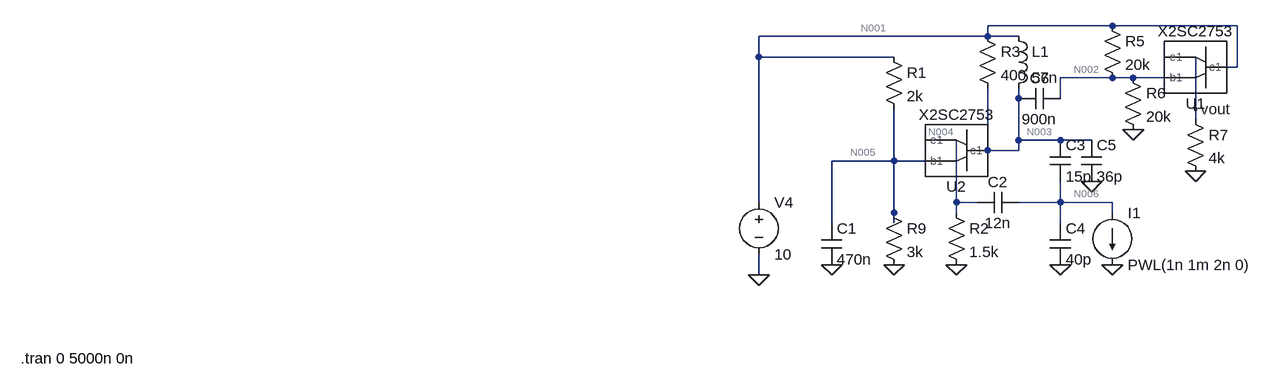
[diagram p0: schematic Oscillator - Copy - Copy.asc]
Oscillator - Copy - Copy.asc, the LTspice schematic file:
Version 4
SHEET 1 2276 680
WIRE 1216 -48 1024 -48
WIRE 1408 -48 1216 -48
WIRE 1024 -32 1024 -48
WIRE 1024 -32 672 -32
WIRE 1072 -32 1024 -32
WIRE 672 0 672 -32
WIRE 880 0 672 0
WIRE 1344 0 1296 0
WIRE 1408 16 1408 -48
WIRE 1408 16 1392 16
WIRE 1216 32 1136 32
WIRE 1248 32 1216 32
WIRE 1296 32 1248 32
WIRE 1072 64 1072 48
WIRE 1136 64 1136 32
WIRE 1344 80 1344 0
WIRE 1344 96 1344 80
WIRE 976 128 928 128
WIRE 1072 128 1072 64
WIRE 1136 128 1072 128
WIRE 1184 128 1136 128
WIRE 1024 144 1024 48
WIRE 1072 144 1072 128
WIRE 1072 144 1024 144
WIRE 880 160 880 80
WIRE 880 160 784 160
WIRE 928 160 880 160
WIRE 672 224 672 0
WIRE 976 224 976 128
WIRE 1008 224 976 224
WIRE 1136 224 1136 192
WIRE 1136 224 1072 224
WIRE 1216 224 1136 224
WIRE 880 240 880 160
WIRE 976 240 976 224
WIRE 1216 240 1216 224
WIRE 784 256 784 160
WIRE 880 256 880 240
WIRE 1136 256 1136 224
WIRE 672 336 672 304
FLAG 672 336 0
FLAG 880 320 0
FLAG 1216 320 0
FLAG 976 320 0
FLAG 784 320 0
FLAG 1136 320 0
FLAG 1248 112 0
FLAG 1344 176 0
FLAG 1184 192 0
FLAG 1344 80 vout
SYMBOL AutoGenerated\\X2SC2753 976 144 R180
SYMATTR InstName U2
SYMBOL res 864 224 R0
SYMATTR InstName R9
SYMATTR Value 3k
SYMBOL voltage 672 208 R0
WINDOW 123 0 0 Left 0
WINDOW 39 0 0 Left 0
SYMATTR InstName V4
SYMATTR Value 10
SYMBOL current 1216 240 R0
WINDOW 123 0 0 Left 0
WINDOW 39 0 0 Left 0
SYMATTR InstName I1
SYMATTR Value PWL(1n 1m 2n 0)
SYMBOL res 864 -16 R0
SYMATTR InstName R1
SYMATTR Value 2k
SYMBOL res 960 224 R0
SYMATTR InstName R2
SYMATTR Value 1.5k
SYMBOL cap 768 256 R0
SYMATTR InstName C1
SYMATTR Value 470n
SYMBOL ind 1056 -48 R0
SYMATTR InstName L1
SYMATTR Value 57n
SYMBOL cap 1072 208 R90
WINDOW 0 0 32 VBottom 2
WINDOW 3 32 32 VTop 2
SYMATTR InstName C2
SYMATTR Value 12n
SYMBOL cap 1120 128 R0
SYMATTR InstName C3
SYMATTR Value 15p
SYMBOL cap 1120 256 R0
SYMATTR InstName C4
SYMATTR Value 40p
SYMBOL res 1008 -48 R0
SYMATTR InstName R3
SYMATTR Value 400
SYMBOL cap 1168 128 R0
SYMATTR InstName C5
SYMATTR Value 36p
SYMBOL AutoGenerated\\X2SC2753 1344 16 R180
SYMATTR InstName U1
SYMBOL res 1200 -64 R0
SYMATTR InstName R5
SYMATTR Value 20k
SYMBOL res 1232 16 R0
SYMATTR InstName R6
SYMATTR Value 20k
SYMBOL res 1328 80 R0
SYMATTR InstName R7
SYMATTR Value 4k
SYMBOL cap 1136 48 R90
WINDOW 0 0 32 VBottom 2
WINDOW 3 32 32 VTop 2
SYMATTR InstName C6
SYMATTR Value 900n
TEXT -464 464 Left 2 !.tran 0 5000n 0n

The netlist it stands for:
* Oscillator - Copy - Copy.asc
XU2 N003 N005 N004 X2SC2753  ; pins c1 b1 e1
R9 N005 0 3k
V4 N001 0 10
I1 N006 0 PWL(1n 1m 2n 0)
R1 N001 N005 2k
R2 N004 0 1.5k
C1 N005 0 470n
L1 N001 N003 57n
C2 N006 N004 12n
C3 N003 N006 15p
C4 N006 0 40p
R3 N001 N003 400
C5 N003 0 36p
XU1 N001 N002 vout X2SC2753  ; pins c1 b1 e1
R5 N001 N002 20k
R6 N002 0 20k
R7 vout 0 4k
C6 N002 N003 900n
.tran 0 5000n 0n
.lib C:/Users/jonathansharir-smith/Desktop/251SPICE/Lab2/narrowband\2SC2753.lib
.backanno
.end

* Results of the author's LTspice run, read from the files saved beside the schematic
* Operating Point, zero values left out:
*   V(n005) = 5.942 V
*   V(n003) = 10 V
*   V(n004) = 5.141 V
*   V(n001) = 10 V
*   V(n006) = -1 GV
*   V(n002) = 4.844 V
*   V(vout) = 4.076 V
*   I(C2) = -12 pA
*   I(L1) = 3.379 mA
*   I(I1) = 1 mA
*   I(R9) = 1.981 mA
*   I(R1) = 2.029 mA
*   I(R2) = 3.427 mA
*   I(R3) = 8.447 nA
*   I(R5) = 257.8 µA
*   I(R6) = 242.2 µA
*   I(R7) = 1.019 mA
*   I(V4) = -6.669 mA
*   Ix(u2:C1) = 3.379 mA
*   Ix(u2:B1) = 48.67 µA
*   Ix(u2:E1) = -3.427 mA
*   Ix(u1:C1) = 1.003 mA
*   Ix(u1:B1) = 15.59 µA
*   Ix(u1:E1) = -1.019 mA